# EAGLE design zigduino-micro-1 (EAGLE 6.3)
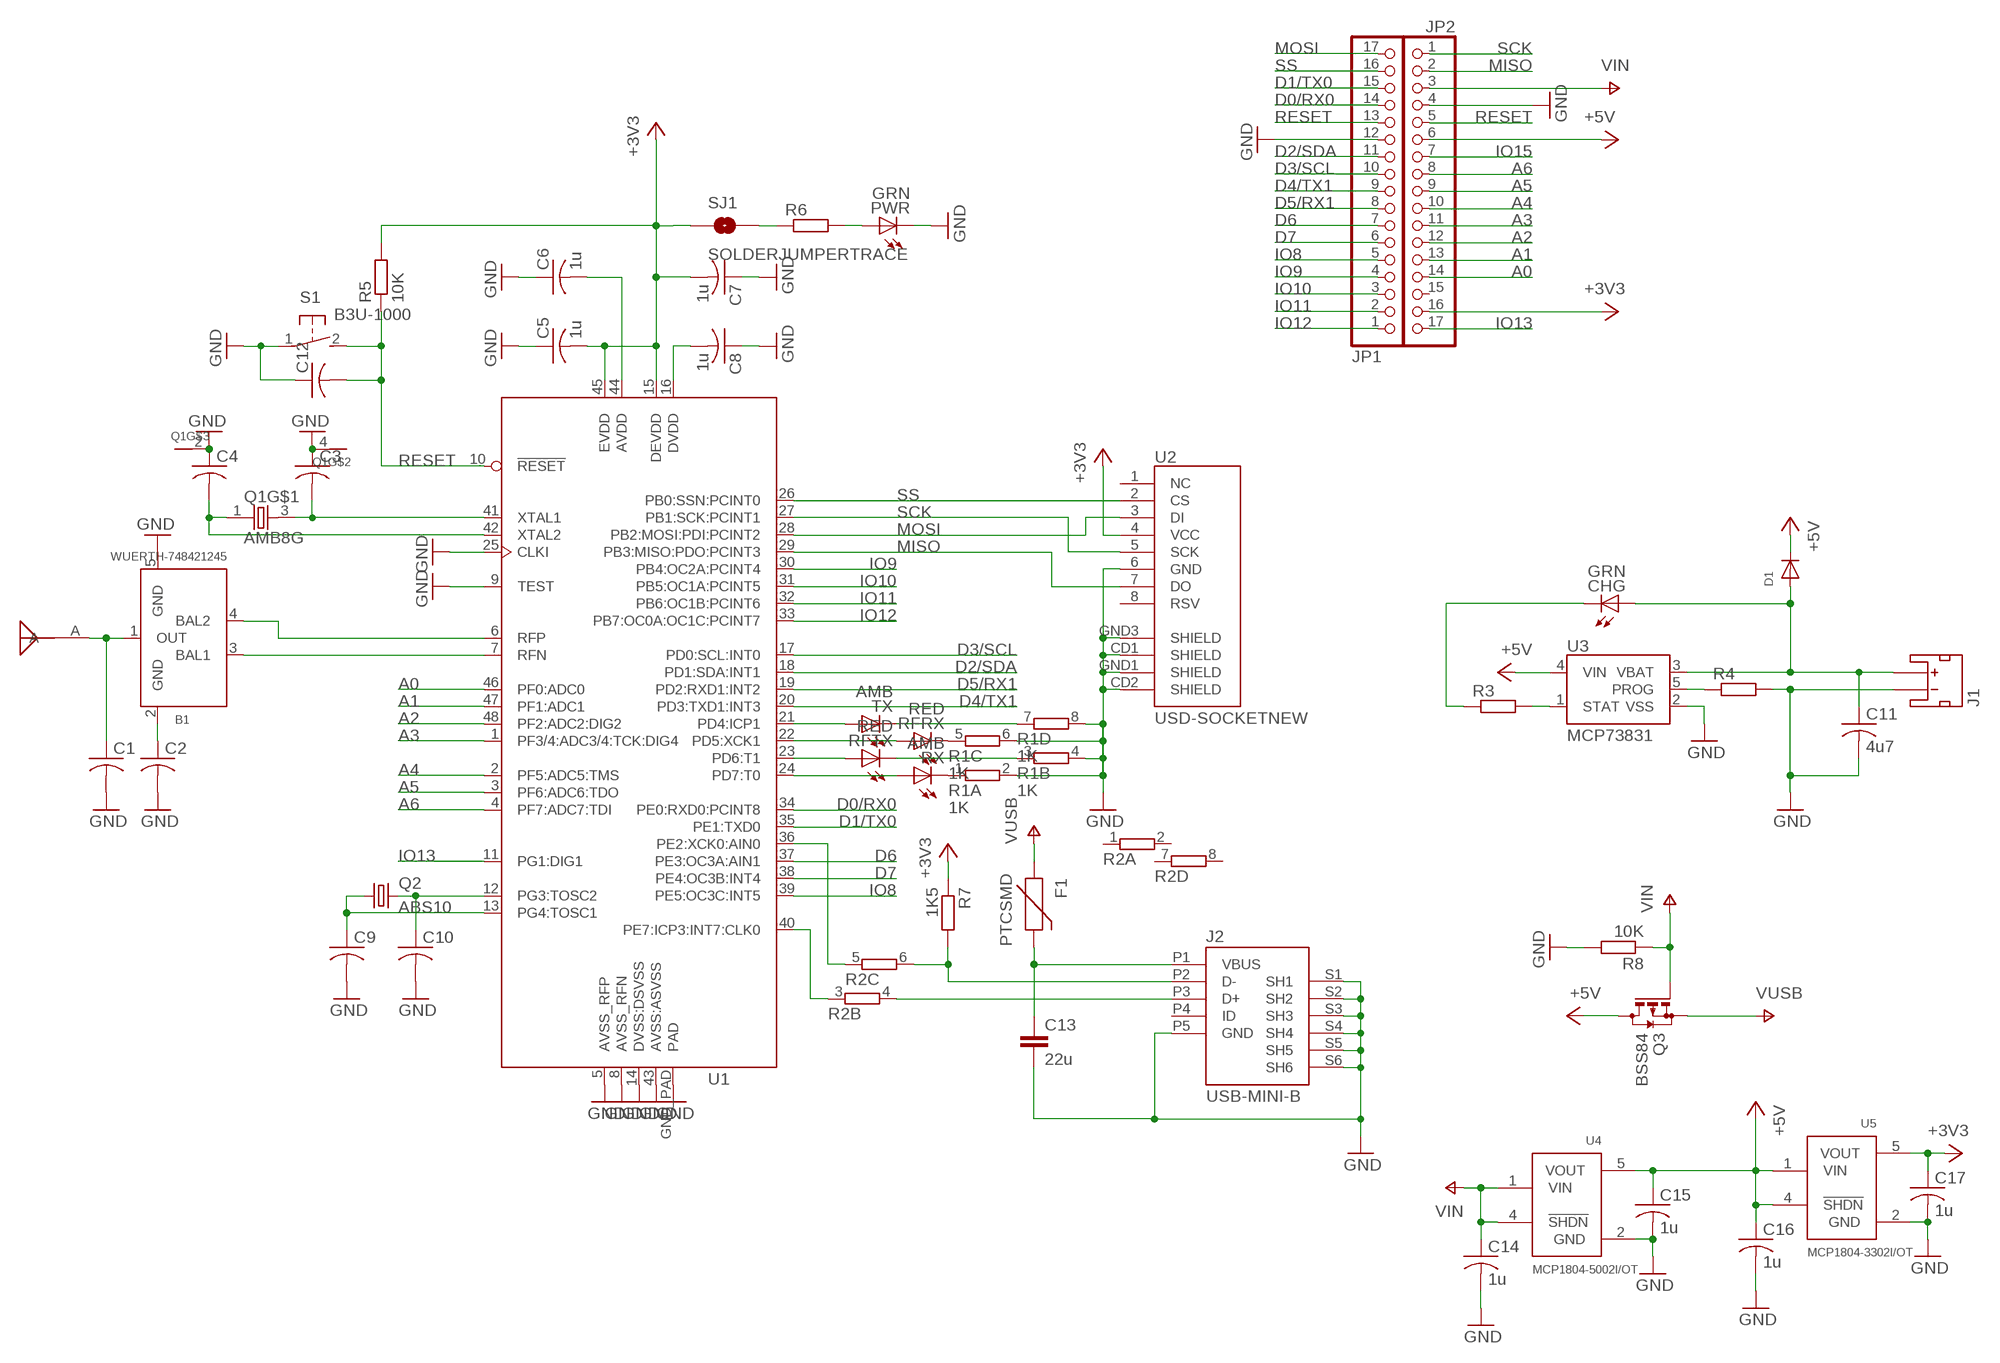
[diagram p0: schematic, sheet 1]

## Parts
ANT1  ATMEGA128RFA1_MOLEX-ANT  [ATMEGA128RFA1_MOLEX-ANT]
B1  WUERTH-748421245  [WURTH-BALUN]
C1  C-USC0402  [C0402]
C2  C-USC0402  [C0402]
C3  C-USC0402  [C0402]
C4  C-USC0402  [C0402]
C5  1u  C-USC0402  [C0402]
C6  1u  C-USC0402  [C0402]
C7  1u  C-USC0402  [C0402]
C8  1u  C-USC0402  [C0402]
C9  C-USC0402  [C0402]
C10  C-USC0402  [C0402]
C11  4u7  C-USC0402  [C0402]
C12  C-USC0402  [C0402]
C13  22u  C-EUC0805  [C0805]
C14  1u  C-USC0402  [C0402]
C15  1u  C-USC0402  [C0402]
C16  1u  C-USC0402  [C0402]
C17  1u  C-USC0402  [C0402]
CHG  GRN  LEDCHIPLED_0603  [CHIPLED_0603]
D1  DIODESOD-123  [SOD-123]
F1  PTCSMD  [PTC-1206]
J1  JST_2MM_MALE  [JST-2-SMD]
J2  USB-MINI-B  [SMARTPRJ_CON2_USB_MICRO_B_AT]
JP1  PINHD-1X17_2.54-SMD  [1X17SMD]
JP2  PINHD-1X17_2.54-SMD  [1X17SMD]
PWR  GRN  LEDCHIPLED_0603  [CHIPLED_0603]
Q1  AMB8G  [ABM8G]
Q2  ABS10  [ABS10]
Q3  BSS84  [SOT23]
R1  1K  4R-NCTS742C083  [CTS742C083-RES]
R2  4R-NCTS742C083  [CTS742C083-RES]
R3  R-EU_R0402  [R0402]
R4  R-EU_R0402  [R0402]
R5  10K  R-EU_R0402  [R0402]
R6  R-EU_R0402  [R0402]
R7  1K5  R-EU_R0402  [R0402]
R8  10K  R-EU_R0402  [R0402]
RFRX  RED  LEDCHIPLED_0603  [CHIPLED_0603]
RFTX  RED  LEDCHIPLED_0603  [CHIPLED_0603]
RX  AMB  LEDCHIPLED_0603  [CHIPLED_0603]
S1  B3U-1000  [B3U]
SJ1  SOLDERJUMPERTRACE  [SJ_2S-TRACE]
TX  AMB  LEDCHIPLED_0603  [CHIPLED_0603]
U1  ATMEGA1284RFR2  [QFN48]
U2  USD-SOCKETNEW  [MICRO-SD-SOCKET-PP]
U3  MCP73831  [SOT23-5]
U4  MCP1804-5002I/OT  [SOT23-5L]
U5  MCP1804-3302I/OT  [SOT23-5L]

## Nets
+3V3: C5.2 C7.2 C17.1 JP2.16 R5.2 R7.1 SJ1.1 U1.15(DEVDD) U1.45(EVDD) U2.4(VCC) U5.5(VOUT)
+5V: C15.1 C16.1 D1.C JP2.6 Q3.3(D) U3.4(VIN) U4.5(VOUT) U5.1(VIN) U5.4(!SHDN!)
A0: JP2.14 U1.46(PF0:ADC0)
A1: JP2.13 U1.47(PF1:ADC1)
A2: JP2.12 U1.48(PF2:ADC2:DIG2)
A3: JP2.11 U1.1(PF3/4:ADC3/4:TCK:DIG4)
A4: JP2.10 U1.2(PF5:ADC5:TMS)
A5: JP2.9 U1.3(PF6:ADC6:TDO)
A6: JP2.8 U1.4(PF7:ADC7:TDI)
D0/RX0: JP1.14 U1.34(PE0:RXD0:PCINT8)
D1/TX0: JP1.15 U1.35(PE1:TXD0)
D2/SDA: JP1.11 U1.18(PD1:SDA:INT1)
D3/SCL: JP1.10 U1.17(PD0:SCL:INT0)
D4/TX1: JP1.9 U1.20(PD3:TXD1:INT3)
D5/RX1: JP1.8 U1.19(PD2:RXD1:INT2)
D6: JP1.7 U1.37(PE3:OC3A:AIN1)
D7: JP1.6 U1.38(PE4:OC3B:INT4)
GND: B1.5(GND) C1.2 C2.2 C3.1 C4.1 C5.1 C6.1 C7.1 C8.1 C9.2 C10.2 C11.2 C12.1 C13.2 C14.2 C15.2 C16.2 C17.2 J1.1(-) J2.P5(GND) J2.S1(SH1) J2.S2(SH2) J2.S3(SH3) J2.S4(SH4) J2.S5(SH5) J2.S6(SH6) JP1.12 JP2.4 PWR.C Q1.2(PIN) Q1.4(PIN) R1.2 R1.4 R1.6 R1.8 R4.2 R8.2 S1.1 U1.5(AVSS_RFP) U1.8(AVSS_RFN) U1.9(TEST) U1.14(DVSS:DSVSS) U1.25(CLKI) U1.43(AVSS:ASVSS) U1.GND_PAD(PAD) U2.6(GND) U2.CD1(SHIELD) U2.CD2(SHIELD) U2.GND1(SHIELD) U2.GND3(SHIELD) U3.2(VSS) U4.2(GND) U5.2(GND)
IO8: JP1.5 U1.39(PE5:OC3C:INT5)
IO9: JP1.4 U1.30(PB4:OC2A:PCINT4)
IO10: JP1.3 U1.31(PB5:OC1A:PCINT5)
IO11: JP1.2 U1.32(PB6:OC1B:PCINT6)
IO12: JP1.1 U1.33(PB7:OC0A:OC1C:PCINT7)
IO13: JP2.17 U1.11(PG1:DIG1)
IO15: JP2.7
MISO: JP2.2 U1.29(PB3:MISO:PDO:PCINT3) U2.7(DO)
MOSI: JP1.17 U1.28(PB2:MOSI:PDI:PCINT2) U2.3(DI)
N$1: ANT1.A B1.1(OUT) C1.1
N$2: B1.3(BAL1) U1.7(RFN)
N$3: B1.4(BAL2) U1.6(RFP)
N$4: B1.2(GND) C2.1
N$5: C3.2 Q1.3 U1.41(XTAL1)
N$6: C10.1 Q2.2 U1.12(PG3:TOSC2)
N$7: C4.2 Q1.1 U1.42(XTAL2)
N$8: C6.2 U1.44(AVDD)
N$9: C9.1 Q2.1 U1.13(PG4:TOSC1)
N$10: C8.2 U1.16(DVDD)
N$11: RX.A U1.24(PD7:T0)
N$12: R2.3 U1.40(PE7:ICP3:INT7:CLK0)
N$13: R2.5 U1.36(PE2:XCK0:AIN0)
N$14: RFTX.A U1.23(PD6:T1)
N$15: PWR.A R6.2
N$16: RFRX.A U1.22(PD5:XCK1)
N$17: R1.5 RFRX.C
N$18: R1.3 RFTX.C
N$19: J2.P2(D-) R2.6 R7.2
N$20: J2.P3(D+) R2.4
N$21: R1.1 RX.C
N$22: TX.A U1.21(PD4:ICP1)
N$23: R6.1 SJ1.2
N$24: R1.7 TX.C
N$25: C11.1 CHG.A D1.A J1.2(+) U3.3(VBAT)
N$26: R3.2 U3.1(STAT)
N$27: R4.1 U3.5(PROG)
N$28: C13.1 F1.2 J2.P1(VBUS)
N$29: CHG.C R3.1
RESET: C12.2 JP1.13 JP2.5 R5.1 S1.2 U1.10(!RESET!)
SCK: JP2.1 U1.27(PB1:SCK:PCINT1) U2.5(SCK)
SS: JP1.16 U1.26(PB0:SSN:PCINT0) U2.2(CS)
VIN: C14.1 JP2.3 Q3.1(G) R8.1 U4.1(VIN) U4.4(!SHDN!)
VUSB: F1.1 Q3.2(S)
Unconnected: J1.NC1(PAD1) J1.NC2(PAD2) J2.P4(ID) JP2.15 R2.1 R2.2 R2.7 R2.8 U2.1(NC) U2.8(RSV)

## Library data of the parts
ANT1 = atmega128rfa1:ATMEGA128RFA1_MOLEX-ANT
B1 = atmega128rfa1:WUERTH-748421245: Recommended Balun for Atmega128RFA1
C1-C12 C14-C17 = resistor:C-US: CAPACITOR, American symbol
C13 = resistor:C-EU: CAPACITOR, European symbol
CHG PWR RFRX RFTX RX TX = led:LED: LED OSRAM: - CHIPLED LG R971, LG N971, LY N971, LG Q971, LY Q971, LO R971, LY R971 LH N974, LH R974 LS Q976, LO Q976, LY Q976 LO Q996 - Hyper CHIPLED LW Q18S LB Q993, LB Q99A, LB R99A - SideLED LS A670, LO A670, LY A670, LG A670, LP A670 LB A673, LV A673, LT A673, LW A673 LH A674 LY A675 LS A676, LA A676, LO A676, LY A676, LW A676 LS A679, LY A679, LG A679 - Hyper Micro SIDELED® LS Y876, LA Y876, LO Y876, LY Y876 LT Y87S - SmartLED LW L88C, LW L88S LB L89C, LB L89S, LG L890 LS L89K, LO L89K, LY L89K LS L896, LA L896, LO L896, LY L896 - TOPLED LS T670, LO T670, LY T670, LG T670, LP T670 LSG T670, LSP T670, LSY T670, LOP T670, LYG T670 LG T671, LOG T671, LSG T671 LB T673, LV T673, LT T673, LW T673 LH T674 LS T676, LA T676, LO T676, LY T676, LB T676, LH T676, LSB T676, LW T676 LB T67C, LV T67C, LT T67C, LS T67K, LO T67K, LY T67K, LW E67C LS E67B, LA E67B, LO E67B, LY E67B, LB E67C, LV E67C, LT E67C LW T67C LS T679, LY T679, LG T679 LS T770, LO T770, LY T770, LG T770, LP T770 LB T773, LV T773, LT T773, LW T773 LH T774 LS E675, LA E675, LY E675, LS T675 LS T776, LA T776, LO T776, LY T776, LB T776 LHGB T686 LT T68C, LB T68C - Hyper Mini TOPLED® LB M676 - Mini TOPLED Santana® LG M470 LS M47K, LO M47K, LY M47K Source: http://www.osram.convergy.de/
D1 = adafruit:DIODE: Diode SMADIODE - SMA Surface Mount Package 20V 1A Schottky Diode Digikey: 641-1014-6-ND DO-1N4148 - Through Hole Small Current Diode SOD-123 20V 1 A (.5mV Vf) Schottky Diode - Digikey: MBRX120TPMSCT-ND SOD-323 10V 570mA (.38mV Vf, 3ns) Schottky Diode - Digikey: ZLLS410CT-ND SOD-523 30V 30mA Schottky Diode (RB751S-40TE61) - Digikey: RB751S-40TE61CT-ND SOT23-R/W - SOT23 Package (R = Solder Paste/Reflow Ovens, W = Hand-Soldering) BAT54Film 40V 300mA - Digikey: 497-7162-1-ND
F1 = SparkFun-PowerIC:PTC: Resettable Fuse PTC Resettable Fuse. Spark Fun Electronics SKU : COM-08357
J1 = SparkFun-Connectors:JST_2MM_MALE: Mates to single-cell LiPo batteries. CONN-08352; PROD_ID: CONN-08352
J2 = logos-ftdi:USB-MINI-B
JP1 JP2 = pinhead-1:PINHD-1X17: PIN HEADER
Q1 = atmega128rfa1:AMB8G: AMB8G series ultraminature crystal
Q2 = logos-crystals:ABS10
Q3 = transistor-small-signal:BSS84: P-CHANNEL MOS FET
R1 R2 = res-cap-arrays:4R-N: Array Chip Resistor Source: RS Component / Phycomp
R3-R8 = resistor:R-EU_: RESISTOR, European symbol
S1 = logos-faves:B3U-1000: Omron B3U-1000 SMD tact switch
SJ1 = SparkFun-Passives:SOLDERJUMPER: Solder Jumper Standard SMD solder jumper. Used to automate production. Two varients : Normally Open and Normally Closed are the same, but have different paste layers. NC will have a large amount of paste and should jumper during reflow.
U1 = atmega128rfa1:ATMEGA1284RFR2
U2 = SparkFun-Connectors:USD-SOCKET: microSD Socket Push-push type uSD socket. Schematic element and footprint production proven. Spark Fun Electronics SKU : PRT-00127. tDoc lines correctly indicate media card edge positions when inserting (unlocked, locked, depressed).
U3 = SparkFun-PowerIC:MCP73831: Miniature single cell, fully integrated Li-Ion, Li-polymer charge management controller http://ww1.microchip.com/downloads/en/DeviceDoc/21984a.pdf IC-09995; PROD_ID: IC-09995
U4 U5 = logos-power:MCP1804

## Board
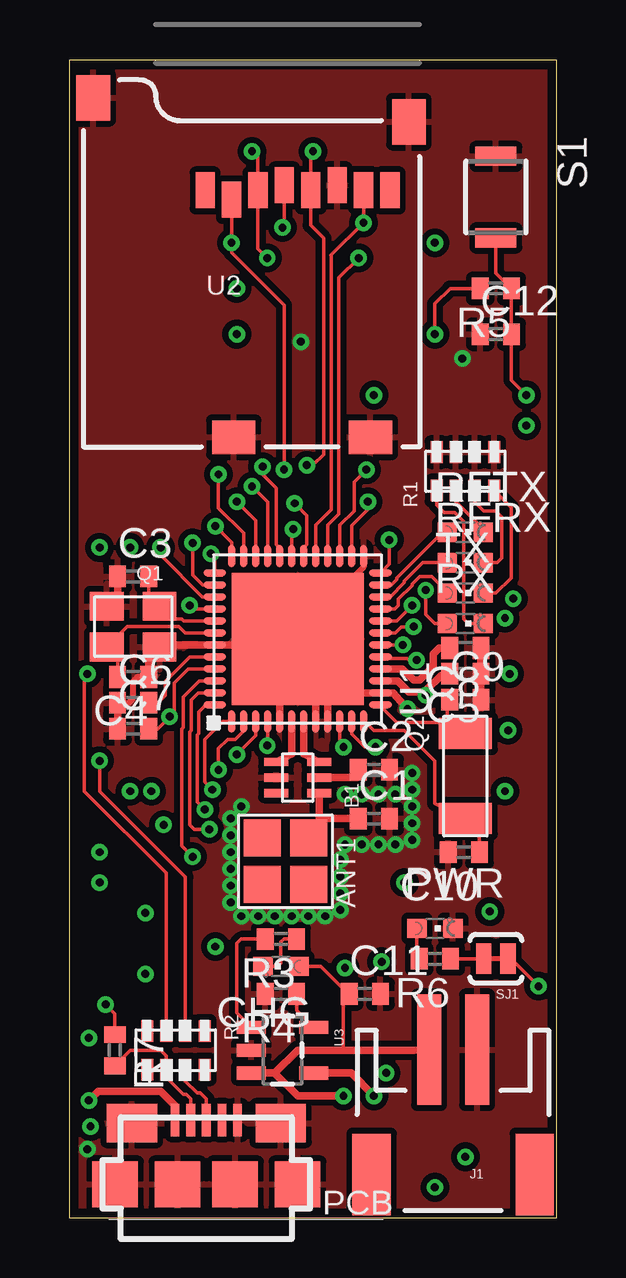
[diagram p1: board, top side]
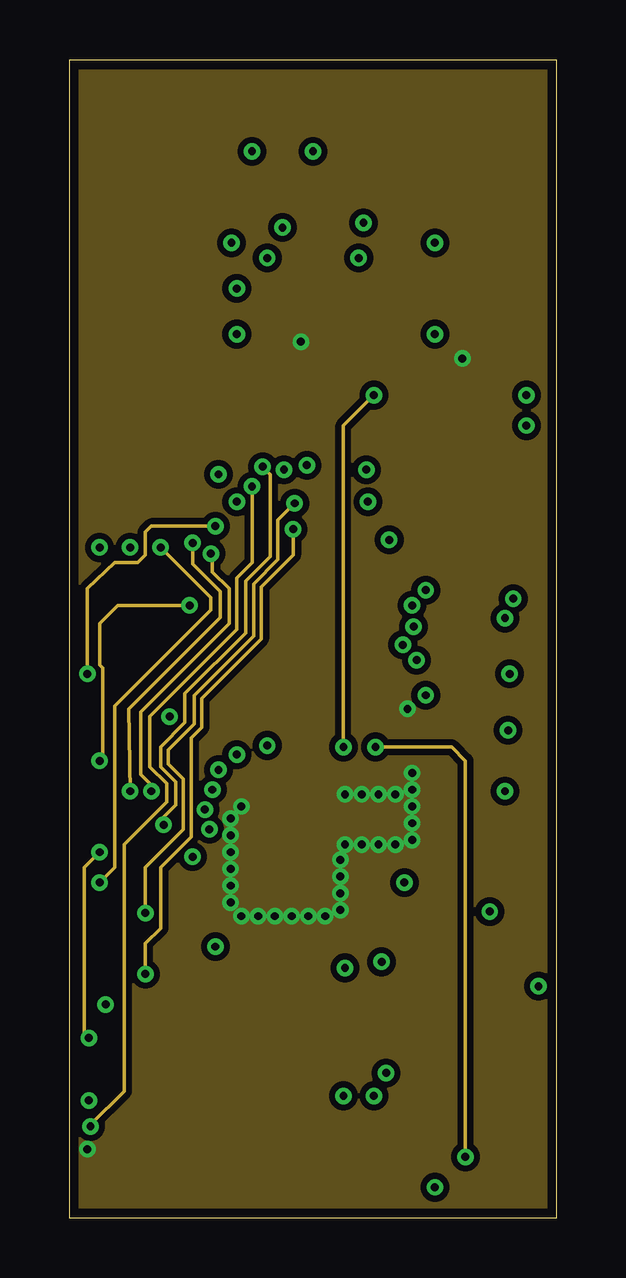
[diagram p2: board, inner layer Route2]
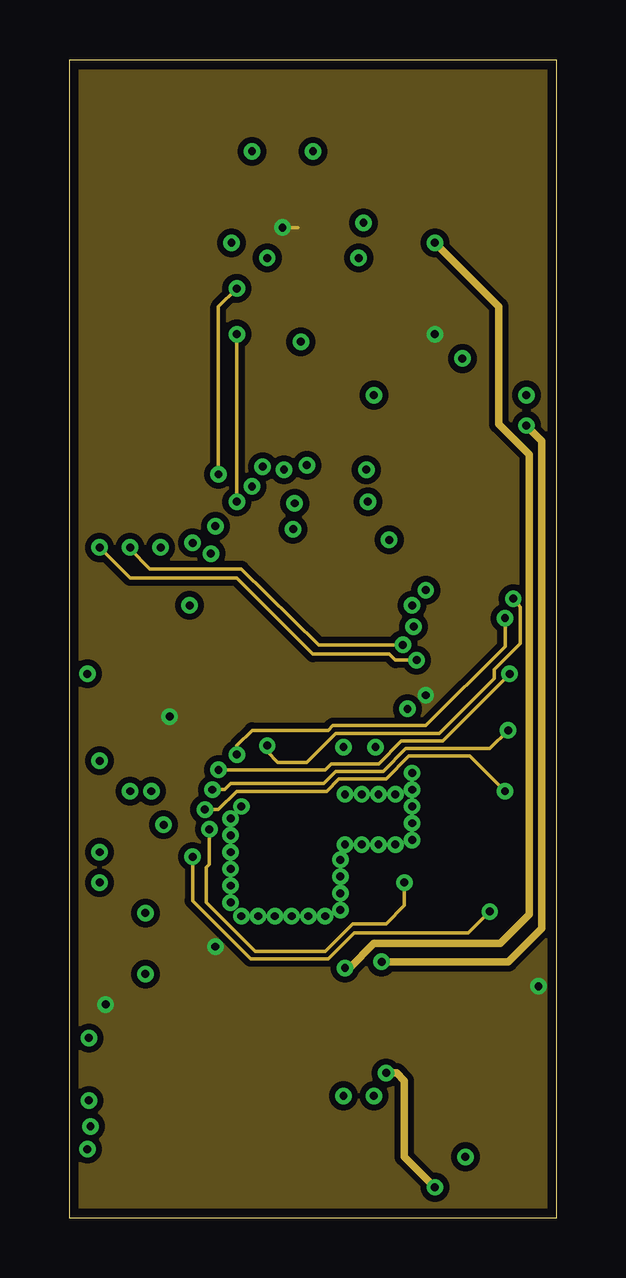
[diagram p3: board, inner layer Route15]
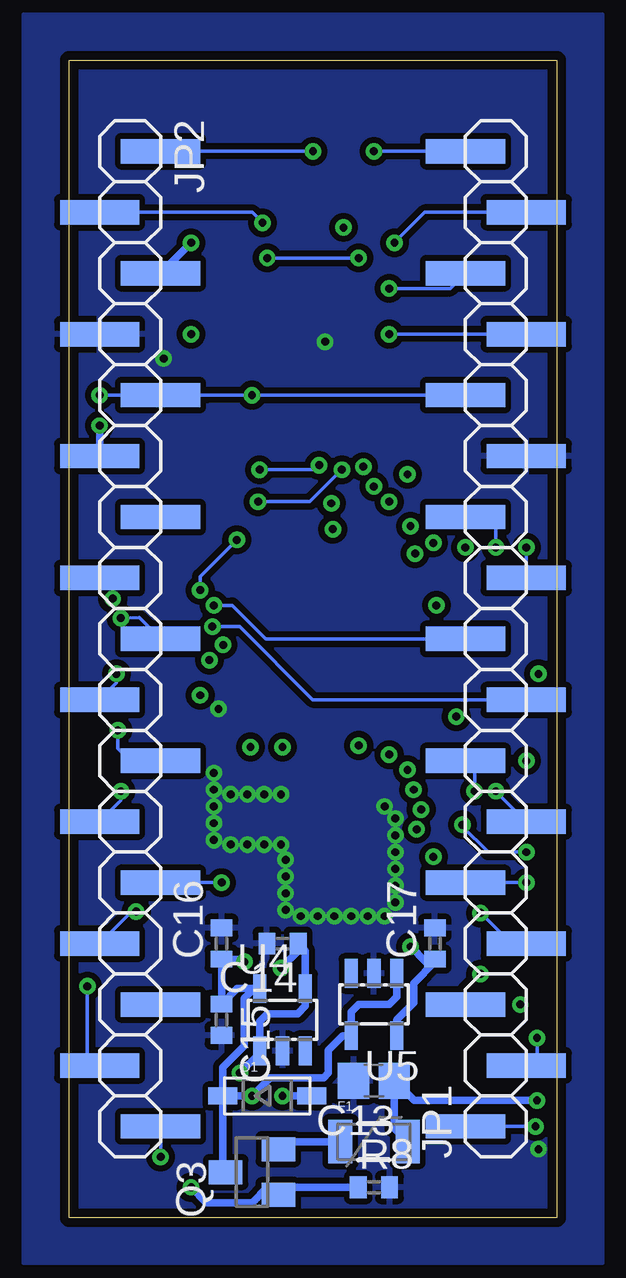
[diagram p4: board, bottom side, seen from below]

Size 20.32 x 48.26 mm. Coordinates in mm from the lower left corner, seen from the top.
Outline: 0,0 20.32,0 20.32,48.26 0,48.26 0,0
Copper layers (1*2+15*16): Top 0.0356mm / dielectric 1.5011mm / Route2 0.0356mm / dielectric 0.1499mm / Route15 0.0356mm / dielectric 0.2007mm / Bottom 0.0356mm
Design rules "LaenPCBOrder *": minimum track width 6mil, minimum drill 13mil, track to track 6mil, track to pad 6mil, pad to pad 6mil, via to via 6mil, smd to smd 6mil, copper to edge 15mil, drill to drill 6mil, minimum pad ring 7mil, minimum via ring 7mil, stop-mask expansion 4mil, vias tented up to drill 0mil, thermal gap 10mil

### Footprints (pad centres in the part's own frame; a part is rotated, then mirrored left to right if it is on the bottom)
ATMEGA128RFA1_MOLEX-ANT = smd 1.54 x 1.54: A -0.97,0.97; D@0 0.97,0.97; D@1 0.97,-0.97; D@2 -0.97,-0.97
WURTH-BALUN = smd 0.35 x 1: 1 0.65,0.9; 2 0,0.9; 3 -0.65,0.9; 4 -0.65,-0.9; 5 0,-0.9; 6 0.65,-0.9
C0402 = smd 0.7 x 0.9: 1 -0.65,0; 2 0.65,0
C0805 = smd 1.3 x 1.5: 1 -0.85,0; 2 0.85,0
CHIPLED_0603 = smd 0.8 x 0.8: A 0,-0.75; C 0,0.75
SOD-123 = smd 1.2 x 0.7: A 1.85,0; C -1.85,0
PTC-1206 = smd 1 x 1.8: 1 -1.4,0; 2 1.4,0
JST-2-SMD = smd 1 x 4.6: 1 -1,-3.7; 2 1,-3.7 | smd 1.6 x 3.4: NC1 -3.4,1.5; NC2 3.4,1.5
SMARTPRJ_CON2_USB_MICRO_B_AT = smd 0.4 x 1.35: P1 -1.3,2.675; P2 -0.65,2.675; P3 0,2.675; P4 0.65,2.675; P5 1.3,2.675 | smd 1.9 x 1.9: S1 -3.8,0; S2 3.8,0; S5 -1.2,0; S6 1.2,0 | smd 2.1 x 1.6: S3 -3.1,2.55; S4 3.1,2.55
1X17SMD = smd 1.016 x 3.302: 1 -1.27,1.27; 2 1.27,-1.27; 3 3.81,1.27; 4 6.35,-1.27; 5 8.89,1.27; 6 11.43,-1.27; 7 13.97,1.27; 8 16.51,-1.27; 9 19.05,1.27; 10 21.59,-1.27; 11 24.13,1.27; 12 26.67,-1.27; 13 29.21,1.27; 14 31.75,-1.27; 15 34.29,1.27; 16 36.83,-1.27; 17 39.37,1.27
ABM8G = smd 1.4 x 1.2: 1 -1.1,-0.85; 2 1.1,-0.85; 3 1.1,0.85; 4 -1.1,0.85
ABS10 = smd 1.3 x 2.2: 1 1.775,0; 2 -1.775,0
SOT23 = smd 1 x 1.4: 1 -0.95,-1.1; 2 0.95,-1.1; 3 0,1.1
CTS742C083-RES = smd 0.9 x 0.5: 1 -0.8,1.2; 2 0.8,1.2; 3 -0.8,0.4; 4 0.8,0.4; 5 -0.8,-0.4; 6 0.8,-0.4; 7 -0.8,-1.2; 8 0.8,-1.2
R0402 = smd 0.7 x 0.9: 1 -0.65,0; 2 0.65,0
B3U = smd 0.8 x 1.7: 1 -1.7,0; 2 1.7,0
SJ_2S-TRACE = smd 0.635 x 1.27: 1 -0.508,0; 2 0.508,0
QFN48 = smd 0.95 x 0.3: 1 -3.45,2.75; 2 -3.45,2.25; 3 -3.45,1.75; 4 -3.45,1.25; 5 -3.45,0.75; 6 -3.45,0.25; 7 -3.45,-0.25; 8 -3.45,-0.75; 9 -3.45,-1.25; 10 -3.45,-1.75; 11 -3.45,-2.25; 12 -3.45,-2.75; 25 3.45,-2.75; 26 3.45,-2.25; 27 3.45,-1.75; 28 3.45,-1.25; 29 3.45,-0.75; 30 3.45,-0.25; 31 3.45,0.25; 32 3.45,0.75; 33 3.45,1.25; 34 3.45,1.75; 35 3.45,2.25; 36 3.45,2.75 | smd 0.3 x 0.95: 13 -2.75,-3.45; 14 -2.25,-3.45; 15 -1.75,-3.45; 16 -1.25,-3.45; 17 -0.75,-3.45; 18 -0.25,-3.45; 19 0.25,-3.45; 20 0.75,-3.45; 21 1.25,-3.45; 22 1.75,-3.45; 23 2.25,-3.45; 24 2.75,-3.45; 37 2.75,3.45; 38 2.25,3.45; 39 1.75,3.45; 40 1.25,3.45; 41 0.75,3.45; 42 0.25,3.45; 43 -0.25,3.45; 44 -0.75,3.45; 45 -1.25,3.45; 46 -1.75,3.45; 47 -2.25,3.45; 48 -2.75,3.45 | smd 5.5 x 5.5: GND_PAD 0,0
MICRO-SD-SOCKET-PP = smd 0.8 x 1.5: 1 -8.94,10.7; 2 -7.84,10.3; 3 -6.74,10.7; 4 -5.64,10.9; 5 -4.54,10.7; 6 -3.44,10.9; 7 -2.34,10.7; 8 -1.24,10.7 | smd 1.8 x 1.4: CD1 -2.05,0.4; CD2 -7.75,0.4 | smd 1.4 x 1.9: GND1 -13.6,14.55; GND3 -0.45,13.55
SOT23-5 = smd 0.55 x 1.2: 1 -0.95,-1.3; 2 0,-1.3; 3 0.95,-1.3; 4 0.95,1.3; 5 -0.95,1.3
SOT23-5L = smd 0.55 x 1.2: 1 -0.95,-1.3; 2 0,-1.3; 3 0.95,-1.3; 4 0.95,1.3; 5 -0.95,1.3

### Placement (x,y rotation side)
ANT1  9.02,14.86 270 top
B1  9.53,18.35 270 top
C1  12.7,16.64 0 top
C2  12.7,18.67 0 top
C3  2.67,26.73 0 top
C4  2.67,22.54 180 top
C5  16.51,22.67 180 top
C6  2.67,21.46 0 top
C7  2.67,20.38 0 top
C8  16.51,23.75 180 top
C9  16.51,21.59 0 top
C10  16.45,15.24 180 top
C11  12.32,9.33 0 top
C12  17.78,36.83 0 top
C13  7.62,5.71 180 bottom
C14  11.43,11.43 180 bottom
C15  13.97,8.26 270 bottom
C16  13.97,11.43 90 bottom
C17  5.08,11.43 90 bottom
CHG  8.83,10.48 90 top
D1  12.06,5.08 0 bottom
F1  7.62,3.17 0 bottom
J1  16,3.3 180 top
J2  5.71,1.4 0 top
JP1  2.54,5.08 90 bottom
JP2  17.78,43.18 270 bottom
PWR  15.24,12.06 270 top
Q1  2.67,24.64 0 top
Q2  16.51,18.41 90 top
Q3  12.7,1.91 90 bottom
R1  16.51,31.11 90 top
R2  4.45,6.99 270 top
R3  8.83,11.62 180 top
R4  8.83,9.33 180 top
R5  17.78,38.73 180 top
R6  15.24,10.79 180 top
R7  1.91,6.99 270 top
R8  7.62,1.27 0 bottom
RFRX  16.51,27.3 270 top
RFTX  16.51,28.57 270 top
RX  16.51,24.77 270 top
S1  17.78,42.55 270 top
SJ1  17.78,10.79 180 top
TX  16.51,26.04 270 top
U1  9.53,24.13 90 top
U2  14.61,32.13 0 top
U3  8.89,6.99 270 top
U4  11.43,8.26 0 bottom
U5  7.62,8.89 180 bottom

### Tracks (layer width: path | path; a pad name or v marks a point on that pad's centre or on a via)
+3V3  (via drill 0.33)
  Top 0.152: U1.45 4.97,22.88 4.38,22.29 4.38,21.08 v4.19,20.89 3.68,20.38 C7.2 | U2.4 8.96,41.35 v8.89,41.27 | R5.2 15.88,38.73 15.24,38.1 v15.24,36.83 | SJ1.1 18.41,10.79 v19.56,9.65 | R7.1 1.91,8.51 v1.52,8.89
  Top 0.305: C5.2 15.75,22.61 15.49,22.61 14.86,21.97 v14.86,21.78 14.73,21.91 14.16,21.91 13.69,22.38 U1.15
  Route15 0.152: v8.89,41.27 9.53,41.27
  Bottom 0.152: v19.56,9.65 19.56,6.86 JP2.16
  Bottom 0.305: C17.1 5.08,10.67 | 5.08,10.67 5.97,9.78 5.97,8.95 6.67,8.26 U5.5 | 5.08,10.67 5.46,10.67 v6.1,11.3
  pour Route15 (isolate 0.254): -1.27,49.53 21.59,49.53 21.59,-1.27 -1.27,-1.27
+5V  (via drill 0.33)
  Top 0.305: v12.7,5.08 11.74,6.04 U3.4
  Route15 0.305: v13.02,10.67 18.29,10.67 19.68,12.06 19.68,32.38 v19.05,33.02
  Bottom 0.305: D1.C v12.7,5.08 11.94,5.84 9.72,5.84 9.53,6.03 9.53,6.99 8.92,7.59 U5.4 8.57,8.57 8.26,8.89 6.99,8.89 6.67,9.21 U5.1 | D1.C 13.91,2.02 Q3.3 | D1.C 13.91,6.28 13.02,7.18 13.02,9.14 12.61,9.55 U4.5 13.32,9.55 C15.1 C16.1 13.13,10.78 v13.02,10.67 | v19.05,33.02 JP2.6
A0  (via drill 0.33)
  Top 0.152: U1.46 5.43,22.38 4.76,21.72 4.76,20.45 4.7,20.38 4.7,15.49 v5.14,15.05
  Route15 0.152: v17.53,12.76 16.64,11.87 11.87,11.87 10.79,10.79 7.56,10.79 5.14,13.21 v5.14,15.05
  Bottom 0.152: v17.53,12.76 17.72,12.76 JP2.14
A1  (via drill 0.33)
  Top 0.152: U1.47 5.37,21.88 5.08,21.59 5.08,20.32 5.02,20.26 5.02,16.38 5.21,16.19 v5.84,16.19
  Route15 0.152: v13.97,13.97 13.97,13.02 13.21,12.26 11.81,12.26 10.67,11.11 7.75,11.11 5.71,13.14 5.71,14.61 5.84,14.73 v5.84,16.19
  Bottom 0.152: JP2.13 v13.97,13.97
A2  (via drill 0.33)
  Top 0.152: U1.48 5.7,21.38 5.4,21.08 5.4,20.19 5.33,20.13 5.33,17.34 v5.65,17.02
  Route15 0.152: v18.16,17.78 16.7,19.24 14.16,19.24 13.21,18.29 11.24,18.29 10.73,17.78 6.99,17.78 6.22,17.02 v5.65,17.02
  Bottom 0.152: v18.16,17.78 18.16,17.4 JP2.12
A3  (via drill 0.33)
  Top 0.152: U1.1 6.39,20.68 5.65,19.94 5.65,18.16 v5.97,17.84
  Route15 0.152: v18.29,20.32 17.53,19.56 14.03,19.56 13.08,18.61 11.11,18.61 10.6,18.1 6.73,18.1 6.48,17.84 v5.97,17.84
  Bottom 0.152: v18.29,20.32 18.29,19.56 17.78,19.05 JP2.11
A4  (via drill 0.33)
  Top 0.152: U1.2 7.28,20.29 6.92,19.94 6.6,19.94 6.22,19.56 v6.22,18.67
  Route15 0.152: v6.22,18.67 10.67,18.67 10.92,18.92 12.89,18.92 13.84,19.88 15.56,19.88 v18.35,22.67
  Bottom 0.152: v18.35,22.67 18.35,22.29 JP2.10
A5  (via drill 0.33)
  Top 0.152: U1.3 7.78,20.09 v6.99,19.3
  Route15 0.152: v6.99,19.3 6.99,19.68 7.62,20.32 10.79,20.32 10.99,20.51 14.86,20.51 18.16,23.81 v18.16,24.99
  Bottom 0.152: v18.16,24.99 17.4,25.02 JP2.9
A6  (via drill 0.33)
  Top 0.152: U1.4 8.28,20.28 v8.26,19.68
  Route15 0.152: v8.26,19.68 8.26,19.43 8.7,18.99 9.91,18.99 11.11,20.19 15.43,20.19 17.72,22.48 17.72,22.86 18.8,23.94 18.8,25.46 v18.5,25.81
  Bottom 0.152: v18.5,25.81 18.48,26.54 JP2.8
D0/RX0  (via drill 0.33)
  Top 0.152: U1.34 7.78,29.05 v6.99,29.84
  Route15 0.152: v6.99,36.83 v6.99,29.84
  Bottom 0.152: JP1.14 v6.99,36.83
D1/TX0  (via drill 0.33)
  Top 0.152: U1.35 7.28,28.54 6.22,29.59 v6.22,30.99
  Route15 0.152: v6.22,30.99 6.22,37.97 v6.99,38.73
  Bottom 0.152: v6.99,38.73 4.45,38.73 JP1.15
D2/SDA  (via drill 0.33)
  Top 0.152: 12.7,23.88 U1.18 v13.9,23.88
  Route15 0.152: v2.54,27.94 2.54,27.88 3.37,27.05 7.18,27.05 10.41,23.88 v13.9,23.88
  Bottom 0.152: v2.54,27.94 2.54,29.21 JP1.11
D3/SCL  (via drill 0.33)
  Top 0.152: v14.48,23.24 14.16,23.24 14.1,23.3 13.05,23.3 U1.17
  Route15 0.152: v14.48,23.24 13.59,23.24 13.34,23.5 10.16,23.5 6.99,26.67 2.54,26.67 v1.27,27.94
  Bottom 0.152: v1.27,27.94 JP1.10
D4/TX1  (via drill 0.33)
  Top 0.152: U1.20 13.64,24.88 v14.29,25.53
  Bottom 0.152: v14.29,25.53 13.53,25.53 12.13,24.13 JP1.9
D5/RX1  (via drill 0.33)
  Top 0.152: U1.19 13.6,24.38 13.84,24.62 14.34,24.62 v14.35,24.64
  Bottom 0.152: v14.35,24.64 13.21,24.64 10.16,21.59 JP1.8
D6  (via drill 0.33)
  Top 0.152: U1.37 6.08,27.52 v5.91,27.69
  Route2 0.152: v5.91,27.69 5.97,27.69 5.97,26.92 6.67,26.23 6.67,24.77 2.98,21.08 2.98,18.48 3.43,18.03 v3.43,17.78
  Bottom 0.152: JP1.7 3.62,19.05 3.43,18.86 v3.43,17.78
D7  (via drill 0.33)
  Top 0.152: U1.38 5.56,26.38 5.14,26.8 v5.14,28.13
  Route2 0.152: v2.54,17.78 2.48,21.21 6.29,25.02 6.29,26.1 5.14,27.24 v5.14,28.13
  Bottom 0.152: JP1.6 v2.54,17.78
GND  (via drill 0.33)
  Top 0.254: C4.1 2.86,22.54 2.67,22.35 2.67,21.65 2.48,21.46 C6.1 | U1.25 12.28,27.13 10.79,25.65
  Top 0.305: U1.8 10.28,23.38 U1.GND_PAD | U1.5 8.78,23.38 U1.GND_PAD | U1.GND_PAD 9.28,23.88 U1.43 3.86,23.88 Q1.2 3.32,23.34 C4.1 | U1.GND_PAD 11.78,21.88 U1.14 13.5,21.88 v14.1,21.21 | C8.1 C5.1 C9.2 | C3.1 2.02,25.94 Q1.4 | C7.1 C6.1 | U1.9 10.78,22.88 U1.GND_PAD | 10.79,25.65 10.79,25.4 U1.GND_PAD
  other vias: 14.29,18.54 14.29,17.84 13.59,17.65 12.89,17.65 12.19,17.65 11.49,17.65 14.29,17.14 14.29,16.45 14.29,15.75 13.59,15.56 12.89,15.56 12.19,15.56 11.49,15.56 11.3,14.92 11.3,14.22 11.3,13.53 11.3,12.83 10.67,12.57 9.97,12.57 9.27,12.57 8.57,12.57 7.87,12.57 7.18,12.57 6.73,13.14 6.73,13.84 6.73,14.54 6.73,15.24 6.73,15.94 6.73,16.64 7.18,17.14 0.76,2.86 16.38,35.81 9.65,36.51
  pour Top (isolate 0.254): 0,48.26 20.32,48.26 20.32,0 0,0
  pour Route2 (isolate 0.254): -0.64,48.9 20.95,48.9 20.95,-0.64 -0.64,-0.64
  pour Bottom (isolate 0.254): -1.91,50.16 22.23,50.16 22.23,-1.91 -1.91,-1.91
IO8  (via drill 0.33)
  Top 0.152: v3.81,27.94 3.81,27.62 5.55,25.88 U1.39
  Route2 0.152: v1.27,13.97 1.91,14.61 1.91,21.34 5.91,25.34 5.91,25.84 v3.81,27.94
  Bottom 0.152: JP1.5 v1.27,13.97
IO9  (via drill 0.33)
  Top 0.152: v9.4,29.78 9.91,29.27 9.91,28.07 9.78,27.94 U1.30
  Route2 0.152: v3.17,12.7 3.17,14.61 4.76,16.19 4.76,18.29 4.13,18.92 4.13,19.49 5.21,20.57 5.21,21.78 7.68,24.26 7.68,26.42 8.7,27.43 8.7,29.08 v9.4,29.78
  Bottom 0.152: JP1.4 1.91,11.43 v3.17,12.7
IO10  (via drill 0.33)
  Top 0.152: U1.31 9.28,28.58 v9.34,28.7
  Route2 0.152: v9.34,28.7 9.34,27.62 8,26.29 8,24.13 5.52,21.65 5.52,20.45 5.08,20 5.08,15.88 3.81,14.61 3.81,12.06 3.17,11.43 v3.17,10.16
  Bottom 0.152: JP1.3 3.81,9.53 v3.17,10.16
IO11  (via drill 0.33)
  Top 0.152: v8.06,31.3 8.06,30.99 8.64,30.42 8.64,28.07 8.78,27.93 U1.32
  Route2 0.152: v1.27,15.24 0.64,14.61 0.64,7.68 v0.83,7.49 | v8.06,31.3 8.38,30.99 8.38,27.56 7.37,26.54 7.37,24.38 4.83,21.84 4.83,20.64 3.81,19.62 3.81,18.8 4.45,18.16 4.45,17.21 3.94,16.7 v3.94,16.38
  Bottom 0.152: v3.94,16.38 3.94,16.32 2.86,15.24 v1.27,15.24 | v0.83,7.49 0.83,6.79 JP1.2
IO12  (via drill 0.33)
  Top 0.152: U1.33 8.28,29.82 v7.62,30.48
  Route2 0.152: v7.62,30.48 7.62,27.3 6.99,26.67 6.99,24.51 3.37,20.89 3.37,18.8 4.06,18.1 4.06,17.34 2.29,15.56 2.29,5.27 0.89,3.87 v0.89,3.81
  Bottom 0.152: v0.89,3.81 JP1.1
IO13  (via drill 0.33)
  Top 0.152: U1.11 11.78,20.17 12.32,19.62 v12.76,19.62
  Route2 0.152: v12.76,19.62 15.94,19.62 16.51,19.05 v16.51,2.54
  Bottom 0.152: v16.51,2.54 JP2.17
MISO  (via drill 0.33)
  Top 0.152: U1.29 10.28,28.88 10.92,29.53 10.92,40.11 10.91,40.12 v12.27,41.48 U2.7
  Bottom 0.152: JP2.2 12.7,41.91 v12.27,41.48
MOSI  (via drill 0.33)
  Top 0.152: v12.06,40.01 11.24,39.18 11.24,29.34 10.78,28.87 U1.28 | v8.26,40.01 7.87,40.4 U2.3 7.87,44.2 v7.62,44.45
  Bottom 0.152: v12.06,40.01 v8.26,40.01 | v7.62,44.45 JP1.17
N$1
  Top 0.305: B1.1 10.43,16.51 | 10.43,16.51 10.43,16.27 ANT1.A | C1.1 10.55,16.64 10.43,16.51
N$2
  Top 0.305: U1.7 9.78,19.33 B1.3
N$3
  Top 0.305: U1.6 9.28,19.33 B1.4
N$4
  Top 0.305: B1.2 12,18.35 12.06,18.41 C2.1
N$5
  Top 0.152: C3.2 3.32,25.94 Q1.3 4.3,24.96 4.7,24.96 4.77,24.88 U1.41
N$6
  Top 0.152: C10.1 17.1,16.05 Q2.2 15.24,17.27 15.24,19.05 13.97,20.32 12.7,20.32 12.34,20.68 U1.12
N$7
  Top 0.152: C4.2 2.02,23.34 Q1.1 2.42,24.64 4.57,24.64 4.83,24.38 U1.42
N$8
  Top 0.152: U1.44 5.03,23.38 4,22.35 4,21.78 3.68,21.46 C6.2
N$9
  Top 0.152: U1.13 12.97,21.32 13.65,20.64 15.74,20.64 | 15.74,20.64 Q2.1 | 15.74,20.64 15.74,21.54 C9.1
N$10
  Top 0.305: U1.16 13.89,22.88 14.35,22.42 14.61,22.42 15.18,22.99 15.18,23.5 15.43,23.75 C8.2
N$11  (via drill 0.33)
  Top 0.152: 13.21,26.86 12.99,26.86 U1.24 13.34,27.24 v13.34,28.26 | RX.A 15.24,24.77 14.86,25.15 v14.86,26.16
  Bottom 0.152: v14.86,26.16 14.86,26.73 v13.34,28.26
N$12  (via drill 0.33)
  Top 0.152: R2.3 4.84,14.21 1.27,17.78 v1.27,19.05 | U1.40 5.16,25.38 v5.02,25.53
  Route2 0.152: v5.02,25.53 2.03,25.53 1.27,24.77 1.27,23.05 1.4,22.92 1.4,19.18 v1.27,19.05
N$13  (via drill 0.33)
  Top 0.152: R2.5 4.04,14.37 0.64,17.78 0.64,22.54 v0.76,22.67 | 6.35,28.57 v6.1,28.83 6.78,28.15 U1.36
  Route2 0.152: v0.76,22.67 0.76,26.23 1.91,27.3 2.86,27.3 3.17,27.62 3.17,28.57 3.43,28.83 v6.1,28.83
N$14
  Top 0.152: U1.23 13.43,26.38 13.65,26.61 13.65,26.67 15.56,28.57 RFTX.A
N$15
  Top 0.152: PWR.A 14.49,10.89 R6.2
N$16
  Top 0.152: U1.22 13.37,25.88 13.97,26.48 13.97,26.54 14.73,27.3 RFRX.A
N$17
  Top 0.152: R1.5 16.91,29.83 17.27,29.46 17.78,29.46 18.03,29.21 18.03,27.5 17.84,27.3 RFRX.C
N$18
  Top 0.152: RFTX.C 17.26,28.71 16.11,29.86 R1.3
N$19
  Top 0.152: R7.2 2.56,6.99 3.81,6.99 4.04,6.75 R2.6 4.04,5.86 4.76,5.14 4.89,5.14 5.07,4.97 J2.P2
N$20
  Top 0.152: R2.4 4.84,5.7 5.33,5.21 5.46,5.21 5.71,4.95 J2.P3
N$21
  Top 0.152: RX.C 16.64,24.77 16.45,24.96 16.45,29.02 16.07,29.4 15.62,29.4 15.31,29.71 R1.1
N$22
  Top 0.152: U1.21 13.57,25.38 13.72,25.53 13.72,25.78 14.29,26.35 14.29,26.42 14.61,26.73 15.11,26.73 15.76,26.09 TX.A
N$23
  Top 0.152: SJ1.2 R6.1
N$24
  Top 0.152: TX.C 17.78,26.04 18.41,26.67 18.41,29.61 R1.7
N$25  (via drill 0.33)
  Top 0.152: CHG.A 10.48,10.48 11.62,9.34 | 11.43,6.99 11.43,8.89 11.62,9.34 | C11.1 11.62,9.34
  Top 0.305: U3.3 8.57,6.04 | 8.57,6.04 9.53,6.99 11.43,6.99 14.35,6.99 J1.2 | 8.57,6.04 8.57,6.03 9.53,5.08 v11.43,5.08
  Bottom 0.305: v11.43,5.08 D1.A
N$26
  Top 0.152: R3.2 7.18,11.62 6.99,11.43 6.99,8.54 U3.1
N$27
  Top 0.152: R4.1 9.48,8.65 U3.5
N$28  (via drill 0.33)
  Top 0.305: J2.P1 4.42,4.67 3.81,5.27 1.21,5.27 v0.83,4.89
  Bottom 0.305: F1.2 6.77,3.73 C13.1 5.94,4.89 v0.83,4.89
N$29
  Top 0.152: CHG.C 8.7,10.48 8.83,10.6 8.83,11.49 8.95,11.62 R3.1
RESET  (via drill 0.33)
  Top 0.152: S1.2 17.78,39.38 R5.1 C12.2 18.43,34.91 v19.05,34.29 | U1.10 11.28,19.78 v11.43,19.62
  Route2 0.152: v11.43,19.62 11.43,33.02 v12.7,34.29
  Bottom 0.152: v19.05,34.29 JP2.5 14.61,34.29 v12.7,34.29 JP1.13
SCK  (via drill 0.33)
  Top 0.152: v12.38,31.18 11.87,30.67 11.87,29.46 11.28,28.86 U1.27 | v9.91,31.37 10.16,31.37 10.6,31.81 10.6,40.83 10.06,41.37 U2.5 10.06,44.35 v10.16,44.45
  Bottom 0.152: v12.38,31.18 10.1,31.18 v9.91,31.37 | v10.16,44.45 JP2.1
SS  (via drill 0.33)
  Top 0.152: U1.26 11.78,28.86 12.45,29.53 12.45,29.78 12.42,29.81 12.41,29.81 v12.45,29.84 | v8.95,31.18 8.95,38.04 6.76,40.23 v6.76,40.64 U2.2
  Bottom 0.152: v12.45,29.84 10.29,29.84 v8.95,31.18 | JP1.16 5.5,41.91 v6.76,40.64
VIN  (via drill 0.33)
  Route15 0.305: v13.21,6.03 13.65,6.03 13.97,5.71 13.97,2.54 v15.24,1.27 | v11.49,10.41 11.68,10.41 12.7,11.43 17.97,11.43 19.18,12.64 19.18,31.81 17.91,33.08 17.91,37.97 v15.24,40.64
  Bottom 0.305: R8.1 11.29,1.27 | 11.29,1.27 Q3.1 | 11.29,1.27 12.06,1.27 12.7,0.64 14.61,0.64 v15.24,1.27 | v13.21,6.03 12.38,6.86 U4.1 12.38,8.19 12.06,8.51 10.79,8.51 10.48,8.82 U4.4 10.48,11.13 C14.1 10.78,11.13 v11.49,10.41 | v15.24,40.64 JP2.3
VUSB
  Bottom 0.305: F1.1 11.28,3.17 Q3.2